# Altium schematic sheet LAN8830_PINOUT.SchDoc
size C; SheetNumber: 2; SheetTotal: 12
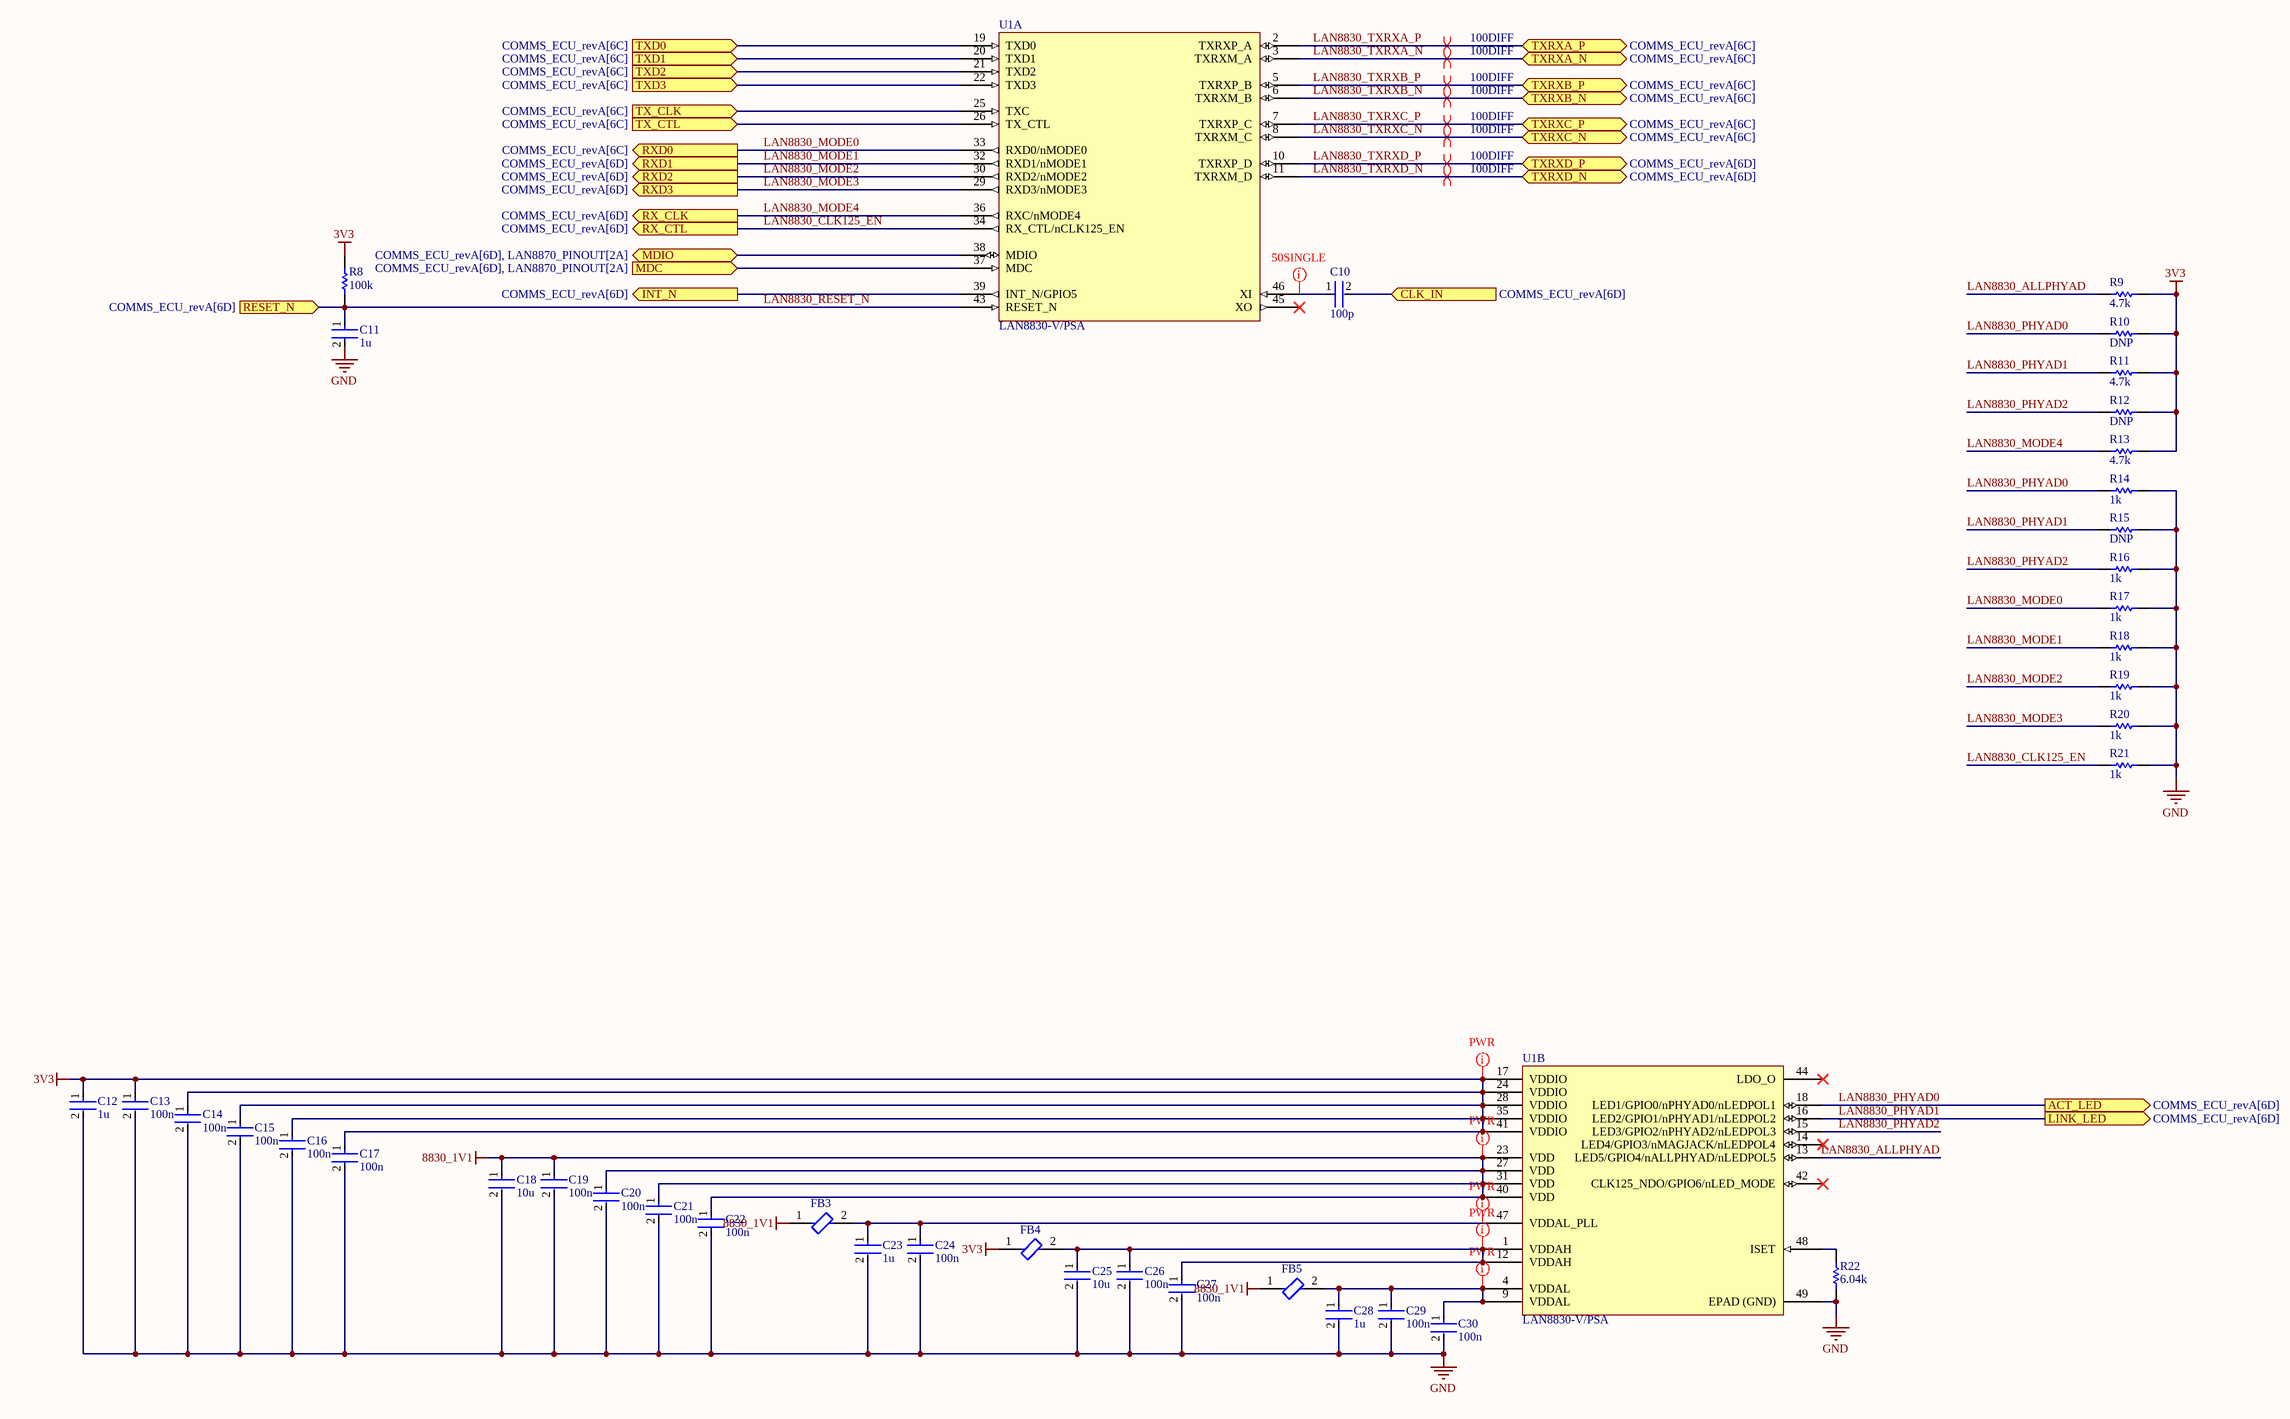
[diagram p0: LAN8830_PINOUT.SchDoc]

## Parts
C10  100p  [FP-0402-L_1_0_0_05-W_0_5-IPC_A]
C11  1u  [FP-0402-L_1_0_0_05-W_0_5-IPC_A]
C12  1u  [FP-0402-L_1_0_0_05-W_0_5-IPC_A]
C13  100n  [FP-0402-L_1_0_0_05-W_0_5-IPC_A]
C14  100n  [FP-0402-L_1_0_0_05-W_0_5-IPC_A]
C15  100n  [FP-0402-L_1_0_0_05-W_0_5-IPC_A]
C16  100n  [FP-0402-L_1_0_0_05-W_0_5-IPC_A]
C17  100n  [FP-0402-L_1_0_0_05-W_0_5-IPC_A]
C18  10u  [FP-0402-L_1_0_0_05-W_0_5-IPC_A]
C19  100n  [FP-0402-L_1_0_0_05-W_0_5-IPC_A]
C20  100n  [FP-0402-L_1_0_0_05-W_0_5-IPC_A]
C21  100n  [FP-0402-L_1_0_0_05-W_0_5-IPC_A]
C22  100n  [FP-0402-L_1_0_0_05-W_0_5-IPC_A]
C23  1u  [FP-0402-L_1_0_0_05-W_0_5-IPC_A]
C24  100n  [FP-0402-L_1_0_0_05-W_0_5-IPC_A]
C25  10u  [FP-0402-L_1_0_0_05-W_0_5-IPC_A]
C26  100n  [FP-0402-L_1_0_0_05-W_0_5-IPC_A]
C27  100n  [FP-0402-L_1_0_0_05-W_0_5-IPC_A]
C28  1u  [FP-0402-L_1_0_0_05-W_0_5-IPC_A]
C29  100n  [FP-0402-L_1_0_0_05-W_0_5-IPC_A]
C30  100n  [FP-0402-L_1_0_0_05-W_0_5-IPC_A]
FB3  BLM18KG331SH1D  [FP-BLM18-0_15-t0_8-IPC_B]  (value not drawn)
FB4  BLM18KG331SH1D  [FP-BLM18-0_15-t0_8-IPC_B]  (value not drawn)
FB5  BLM18KG331SH1D  [FP-BLM18-0_15-t0_8-IPC_B]  (value not drawn)
R8  100k  [R0603B]
R9  4.7k  [R0603B]
R10  DNP  [R0603B]
R11  4.7k  [R0603B]
R12  DNP  [R0603B]
R13  4.7k  [R0603B]
R14  1k  [R0603B]
R15  DNP  [R0603B]
R16  1k  [R0603B]
R17  1k  [R0603B]
R18  1k  [R0603B]
R19  1k  [R0603B]
R20  1k  [R0603B]
R21  1k  [R0603B]
R22  6.04k  [R0603B]
U1  LAN8830-V/PSA  [QFN50P700X700X100_HS-49N]  (parts A,B of 2)

## Ports
ACT_LED (out, see COMMS_ECU_revA[6D]), CLK_IN (in, see COMMS_ECU_revA[6D]), INT_N (out, see COMMS_ECU_revA[6D]), LINK_LED (out, see COMMS_ECU_revA[6D]), MDC (in, see COMMS_ECU_revA[6D], LAN8870_PINOUT[2A]), MDIO (bidir, see COMMS_ECU_revA[6D], LAN8870_PINOUT[2A]), RESET_N (in, see COMMS_ECU_revA[6D]), RX_CLK (out, see COMMS_ECU_revA[6D]), RX_CTL (out, see COMMS_ECU_revA[6D]), RXD0 (out, see COMMS_ECU_revA[6C]), RXD1 (out, see COMMS_ECU_revA[6D]), RXD2 (out, see COMMS_ECU_revA[6D]), RXD3 (out, see COMMS_ECU_revA[6D]), TX_CLK (in, see COMMS_ECU_revA[6C]), TX_CTL (in, see COMMS_ECU_revA[6C]), TXD0 (in, see COMMS_ECU_revA[6C]), TXD1 (in, see COMMS_ECU_revA[6C]), TXD2 (in, see COMMS_ECU_revA[6C]), TXD3 (in, see COMMS_ECU_revA[6C]), TXRXA_N (bidir, see COMMS_ECU_revA[6C]), TXRXA_P (bidir, see COMMS_ECU_revA[6C]), TXRXB_N (bidir, see COMMS_ECU_revA[6C]), TXRXB_P (bidir, see COMMS_ECU_revA[6C]), TXRXC_N (bidir, see COMMS_ECU_revA[6C]), TXRXC_P (bidir, see COMMS_ECU_revA[6C]), TXRXD_N (bidir, see COMMS_ECU_revA[6D]), TXRXD_P (bidir, see COMMS_ECU_revA[6D])

## Nets
3V3: C12.1 C13.1 C14.1 C15.1 C16.1 C17.1 FB4.1 R8.1 R9.1 R10.2 R11.1 R12.2 R13.1 U1.17(VDDIO) U1.24(VDDIO) U1.28(VDDIO) U1.35(VDDIO) U1.41(VDDIO)
8830_1V1: C18.1 C19.1 C20.1 C21.1 C22.1 FB3.1 FB5.1 U1.23(VDD) U1.27(VDD) U1.31(VDD) U1.40(VDD)
GND: C11.2 C12.2 C13.2 C14.2 C15.2 C16.2 C17.2 C18.2 C19.2 C20.2 C21.2 C22.2 C23.2 C24.2 C25.2 C26.2 C27.2 C28.2 C29.2 C30.2 R14.1 R15.2 R16.1 R17.1 R18.1 R19.1 R20.1 R21.1 R22.2 U1.49(EPAD_(GND))
CLK_IN: C10.2 ; port CLK_IN
INT_N: U1.39(INT_N/GPIO5) ; port INT_N
LAN8830_ALLPHYAD: R9.2 U1.13(LED5/GPIO4/nALLPHYAD/nLEDPOL5)
LAN8830_CLK125_EN: R21.2 U1.34(RX_CTL/nCLK125_EN) ; port RX_CTL
LAN8830_MODE0: R17.2 U1.33(RXD0/nMODE0) ; port RXD0
LAN8830_MODE1: R18.2 U1.32(RXD1/nMODE1) ; port RXD1
LAN8830_MODE2: R19.2 U1.30(RXD2/nMODE2) ; port RXD2
LAN8830_MODE3: R20.2 U1.29(RXD3/nMODE3) ; port RXD3
LAN8830_MODE4: R13.2 U1.36(RXC/nMODE4) ; port RX_CLK
LAN8830_PHYAD0: R10.1 R14.2 U1.18(LED1/GPIO0/nPHYAD0/nLEDPOL1) ; port ACT_LED
LAN8830_PHYAD1: R11.2 R15.1 U1.16(LED2/GPIO1/nPHYAD1/nLEDPOL2) ; port LINK_LED
LAN8830_PHYAD2: R12.1 R16.2 U1.15(LED3/GPIO2/nPHYAD2/nLEDPOL3)
LAN8830_RESET_N: C11.1 R8.2 U1.43(RESET_N) ; port RESET_N
LAN8830_TXRXA_N: U1.3(TXRXM_A) ; port TXRXA_N
LAN8830_TXRXA_P: U1.2(TXRXP_A) ; port TXRXA_P
LAN8830_TXRXB_N: U1.6(TXRXM_B) ; port TXRXB_N
LAN8830_TXRXB_P: U1.5(TXRXP_B) ; port TXRXB_P
LAN8830_TXRXC_N: U1.8(TXRXM_C) ; port TXRXC_N
LAN8830_TXRXC_P: U1.7(TXRXP_C) ; port TXRXC_P
LAN8830_TXRXD_N: U1.11(TXRXM_D) ; port TXRXD_N
LAN8830_TXRXD_P: U1.10(TXRXP_D) ; port TXRXD_P
MDC: U1.37(MDC) ; port MDC
MDIO: U1.38(MDIO) ; port MDIO
TX_CLK: U1.25(TXC) ; port TX_CLK
TX_CTL: U1.26(TX_CTL) ; port TX_CTL
TXD0: U1.19(TXD0) ; port TXD0
TXD1: U1.20(TXD1) ; port TXD1
TXD2: U1.21(TXD2) ; port TXD2
TXD3: U1.22(TXD3) ; port TXD3
NetC10_1: C10.1 U1.46(XI)
NetC23_1: C23.1 C24.1 FB3.2 U1.47(VDDAL_PLL)
NetC25_1: C25.1 C26.1 C27.1 FB4.2 U1.1(VDDAH) U1.12(VDDAH)
NetC28_1: C28.1 C29.1 C30.1 FB5.2 U1.4(VDDAL) U1.9(VDDAL)
NetR22_1: R22.1 U1.48(ISET)

Not connected (* = marked no-connect by the designer): U1 14(LED4/GPIO3/nMAGJACK/nLEDPOL4)* 42(CLK125_NDO/GPIO6/nLED_MODE)* 44(LDO_O)* 45(XO)*

## Layout directives
differential pair; differential pair class 100DIFF; differential pair class 1000BASET: LAN8830_TXRXA_N, LAN8830_TXRXA_P, LAN8830_TXRXB_N, LAN8830_TXRXB_P, LAN8830_TXRXC_N, LAN8830_TXRXC_P, LAN8830_TXRXD_N, LAN8830_TXRXD_P
net class PWR: 3V3, 8830_1V1, NetC23_1, NetC25_1, NetC28_1
net class 50SINGLE: NetC10_1

## Library data of the parts
C10-C30 = CMP-001-00058-1: LARGE PADS, 0402 CAP, CHANGE COMMENT TO MATCH REAL P/N; Capacitor Type: Ceramic; Min Operating Temperature: -55°C; Mounting Technology: Surface Mount; Pins: 2; Case/Package: 0402; RoHS Compliant: Yes; Max Operating Temperature: 85°C
FB3-FB5 = CMP-06046-002069-1: Chip Ferrite Bead, 0603, 330Ω @ 100MHz, 0.08Ω, 25%, 1.7A; Number of Lines: 1; DC Resistance (DCR): 80mR; Packaging: Tape and Reel; Case/Package: 0603; Height: 0.037inch; Case Code (Metric): 1608; Length: 0.063inch; Package Quantity: 4000; Max Operating Temperature: 125°C; Case Code (Imperial): 0603; RoHS Compliant: Yes; Width: 0.032inch; Mount: Surface Mount; Min Operating Temperature: -55°C; Ratings: AEC-Q200; Max Current Rating: 1.7A
R8-R22 = CMP-009-00002-14: Resistor
  R8: Value: 100k
  R9 R11 R13: Value: 4.7k
  R10 R12 R15: Value: DNP
  R14 R16-R21: Value: 1k
  R22: Value: 6.04k
U1 = CMP-015-00022-5: LAN8830 Series RGMII Interface Gigabit Ethernet Transceiver - VQFN-48; Case/Package: VQFN; Pins: 48